# Altium schematic sheet Mezclador1.SchDoc
size A4
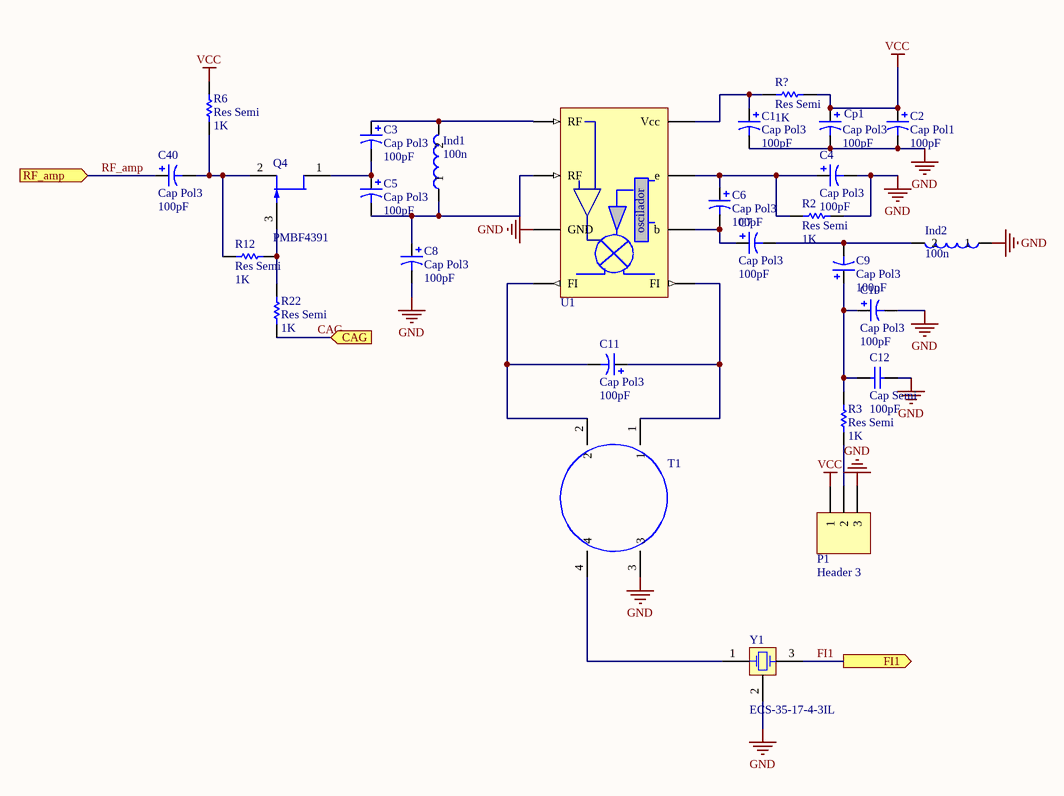
[diagram p0: Mezclador1.SchDoc]

## Parts
C1  Cap Pol3  value 100pF  [C0805]
C2  Cap Pol1  value 100pF  [B]
C3  Cap Pol3  value 100pF  [C0805]
C4  Cap Pol3  value 100pF  [C0805]
C5  Cap Pol3  value 100pF  [C0805]
C6  Cap Pol3  value 100pF  [C0805]
C7  Cap Pol3  value 100pF  [C0805]
C8  Cap Pol3  value 100pF  [C0805]
C9  Cap Pol3  value 100pF  [C0805]
C10  Cap Pol3  value 100pF  [C0805]
C11  Cap Pol3  value 100pF  [C0805]
C12  Cap Semi  value 100pF  [C1206]
C40  Cap Pol3  value 100pF  [C0805]
Cp1  Cap Pol3  value 100pF  [C0805]
Ind1  Valor: 100n  [Ind_5mm]  (hidden comment: Ind2)
Ind2  Valor: 100n  [Ind_4mm]  (hidden comment: Ind2)
P1  Header 3  [HDR1X3]
Q4  PMBF4391  [SOT23_N]
R2  Res Semi  value 1K  [2012[0805]]
R3  Res Semi  value 1K  [2012[0805]]
R6  Res Semi  value 1K  [2012[0805]]
R12  Res Semi  value 1K  [2012[0805]]
R22  Res Semi  value 1K  [2012[0805]]
R?  Res Semi  value 1K  [2012[0805]]
T1  Toroide  [NTH12_4]  (value not drawn)
U1  SA602  [SA602]  (value not drawn)
Y1  ECS-35-17-4-3IL  [HC-49US]

## Ports
CAG (in), FI1 (out), RF_amp (in)

## Nets
GND: C1.2 C2.2 C4.2 C8.2 C10.2 C12.2 Cp1.2 Ind2.1 P1.3 R2.1 T1.3 U1.3(GND) Y1.2(COM)
VCC: C2.1 Cp1.1 P1.1 R6.2 R?.2
CAG: R22.2 ; port CAG
FI1: Y1.3(OSC2) ; port FI1
RF_amp: C40.1 ; port RF_amp
NetC1_1: C1.1 R?.1 U1.8(Vcc)
NetC3_1: C3.1 Ind1.2 U1.1(RF)
NetC3_2: C3.2 C5.1 Q4.1(D)
NetC4_1: C4.1 C6.1 R2.2 U1.7(e)
NetC5_2: C5.2 C8.1 Ind1.1 U1.2(RF)
NetC6_2: C6.2 C7.1 U1.6(b)
NetC7_2: C7.2 C9.2 Ind2.2
NetC9_1: C9.1 C10.1 C12.1 R3.2
NetC11_1: C11.1 T1.1 U1.5(FI)
NetC11_2: C11.2 T1.2 U1.4(FI)
NetC40_2: C40.2 Q4.2(S) R6.1 R12.1
NetP1_2: P1.2 R3.1
NetQ4_3: Q4.3(G) R12.2 R22.1
NetT1_4: T1.4 Y1.1(OSC1)

## Notes on the sheet
- (in symbol SA602A) oscilador

## Library data of the parts
C1 C3-C11 C40 Cp1 = Cap Pol3: Polarized Capacitor (Surface Mount); Published: 8-Jun-2000; LatestRevisionDate: 17-Jul-2002; LatestRevisionNote: Re-released for DXP Platform.; PackageReference: C0805; Publisher: Altium Limited
C2 = Cap Pol1: Polarized Capacitor (Radial); Published: 8-Jun-2000; LatestRevisionDate: 17-Jul-2002; LatestRevisionNote: Re-released for DXP Platform.; PackageReference: RB7.6-15; Publisher: Altium Limited
C12 = Cap Semi: Capacitor (Semiconductor SIM Model); Published: 8-Jun-2000; LatestRevisionDate: 17-Jul-2002; LatestRevisionNote: Re-released for DXP Platform.; PackageReference: C1206; Publisher: Altium Limited
P1 = Header 3: Header, 3-Pin; LatestRevisionDate: 17-Jul-2002; LatestRevisionNote: Re-released for DXP Platform.; Publisher: Altium Limited
Q4 = PMBF4391: N-channel Silicon Junction Field-effect Transistor; Published: 17-Sep-2003; LatestRevisionDate: 12-Dec-2006; LatestRevisionNote: IPC-7351 Footprint Added.; DatasheetVersion: Apr-1995; PackageVersion: May-1999; PackageReference: SOT23; Publisher: Altium Limited; PackageDescription: 3-Pin SOT-23 Package 0.95 mm Pitch, 2.3 mm Lead Span; ComponentLink1Description: Manufacturer Link; ComponentLink1URL: http://www.semiconductors.philips.com/; ComponentLink2Description: Datasheet; ComponentLink2URL: http://www.semiconductors.philips.com/acrobat/datasheets/PMBF4391_4392_4393_CNV_2.pdf
R2 R3 R6 R12 R22 R? = Res Semi: Semiconductor Resistor; Published: 8-Jun-2000; LatestRevisionDate: 17-Jul-2002; LatestRevisionNote: Re-released for DXP Platform.; PackageReference: AXIAL-0.5; Publisher: Altium Limited
T1 = Transformador_Toroide
U1 = SA602A: Mezclador 500MHz
Y1 = ECS-35-17-4-3IL: Crystal Oscillator, 3rd In-Line Lead Version; Published: 17-Jul-2002; DatasheetDocument: 18-Apr-2000; PackageReference: HC-49US; Publisher: Altium Limited; ComponentLink1Description: Manufacturer Link; ComponentLink1URL: http://www.ecsxtal.com/; ComponentLink2Description: Datasheet; ComponentLink2URL: http://www.ecsxtal.com/pdf3/HC_49US.pdf